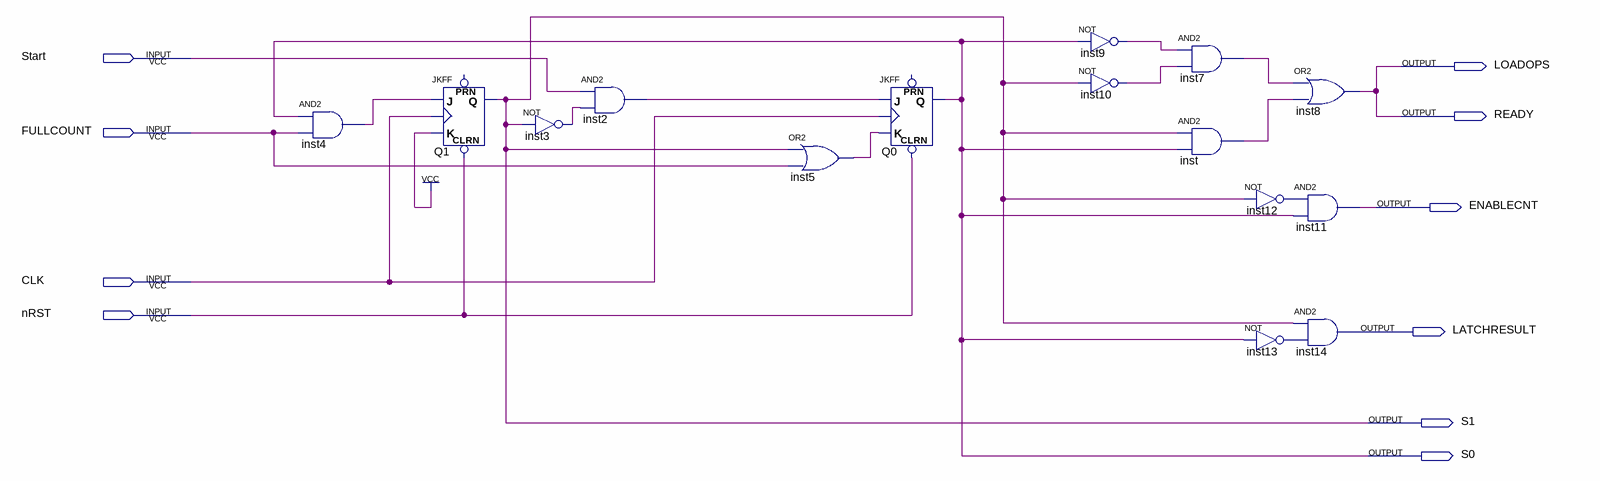
[diagram p0: schematic sheet]
// Quartus schematic sm3.bdf as structural Verilog: 15 symbols, 10 pins
module sm3 (
  input  Start,
  input  FULLCOUNT,
  input  CLK,
  input  nRST,
  output LOADOPS,
  output READY,
  output ENABLECNT,
  output LATCHRESULT,
  output S1,
  output S0
);

  wire inst2_out, inst3_out, inst4_out, inst5_out, inst7_out, inst9_out, inst10_out, inst12_out, inst13_out,
       inst_out;

  and inst4 (inst4_out, S0, FULLCOUNT);
  JKFF Q1 (.CLRN(nRST), .K(1'b1), .J(inst4_out), .CLK(CLK), .Q(S1));  // open: PRN
  and inst2 (inst2_out, Start, inst3_out);
  not inst3 (inst3_out, S1);
  or inst5 (inst5_out, S1, FULLCOUNT);
  JKFF Q0 (.CLRN(nRST), .K(inst5_out), .J(inst2_out), .CLK(CLK), .Q(S0));  // open: PRN
  not inst9 (inst9_out, S0);
  not inst10 (inst10_out, S1);
  and inst7 (inst7_out, inst9_out, inst10_out);
  and inst (inst_out, S1, S0);
  not inst12 (inst12_out, S1);
  not inst13 (inst13_out, S0);
  or inst8 (LOADOPS, inst7_out, inst_out);
  and inst11 (ENABLECNT, inst12_out, S0);
  and inst14 (LATCHRESULT, S1, inst13_out);

  assign READY = LOADOPS;
endmodule
